# EAGLE schematic VCU_itr2 (EAGLE 9.6.2)

## Sheet 1 of 4
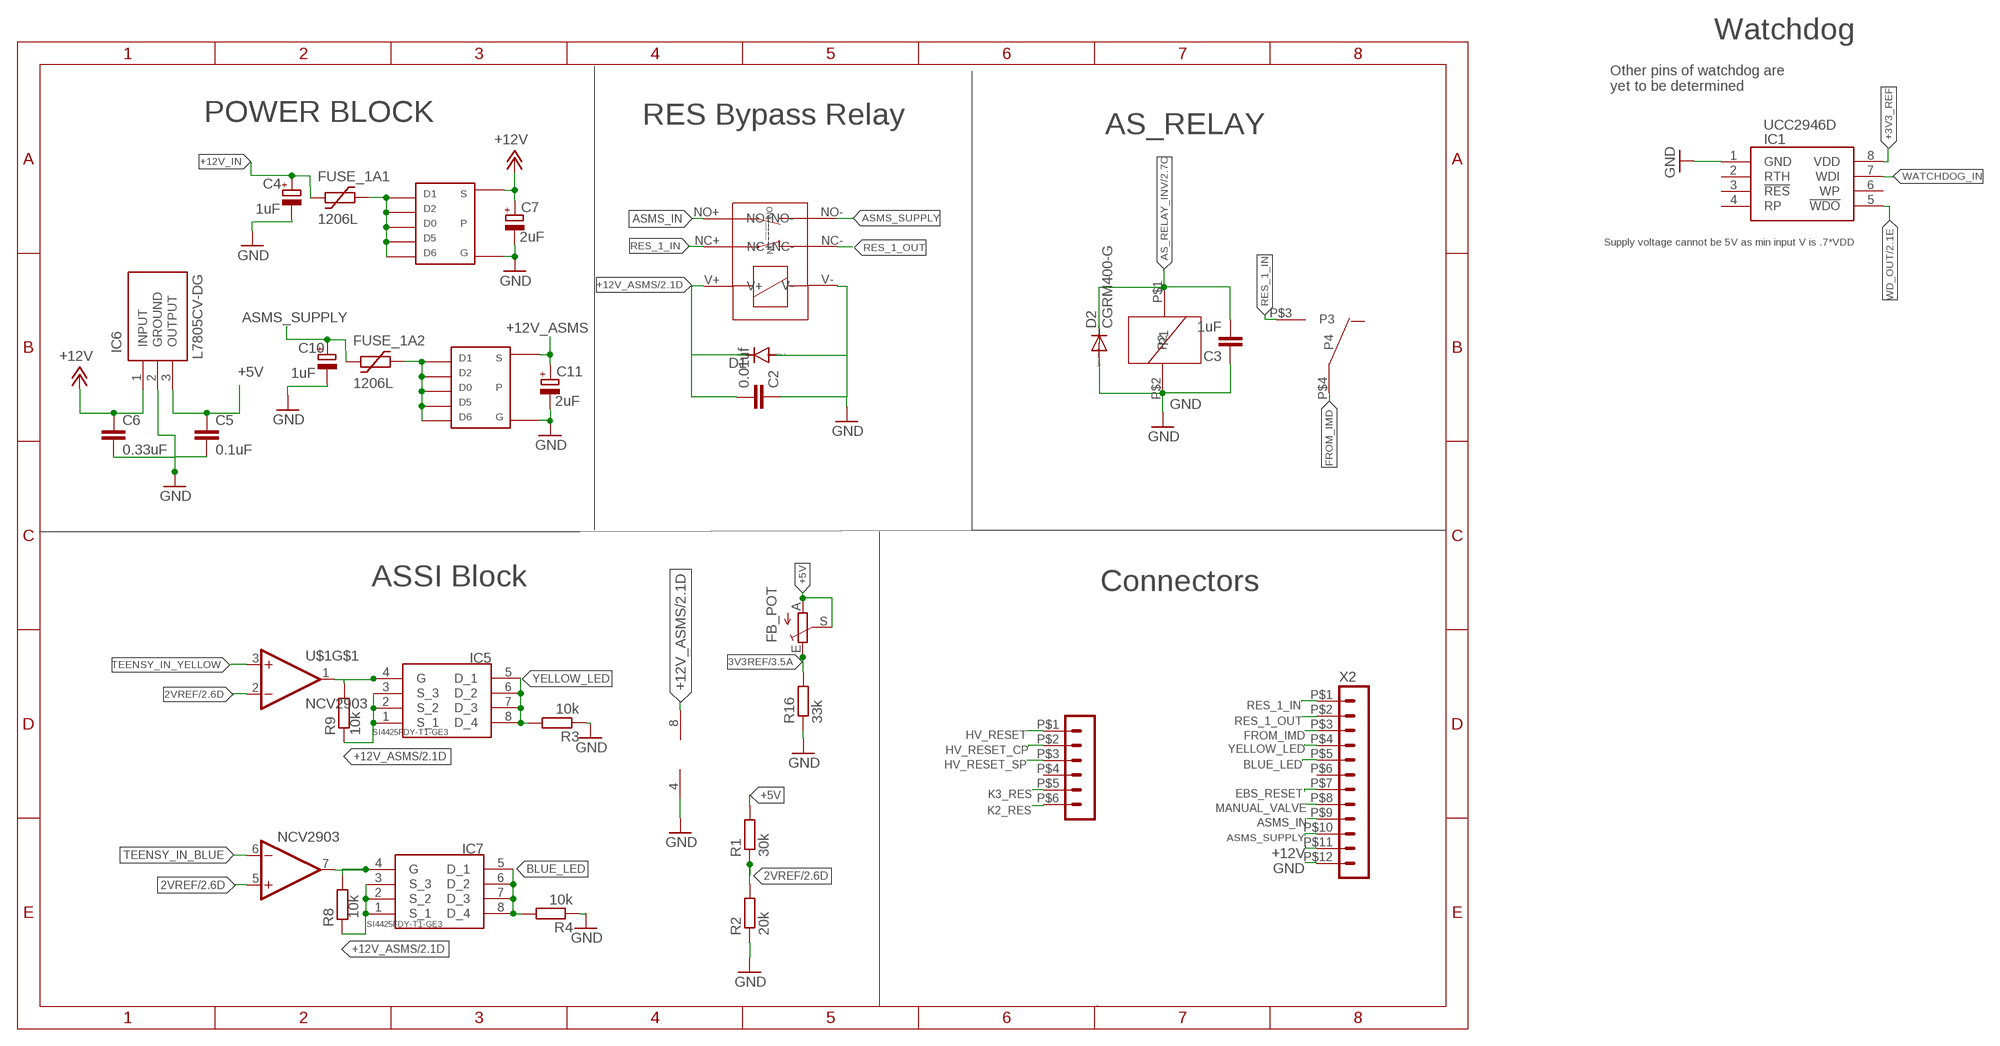
[diagram p0: schematic, sheet 1]

### Parts
BMS-CONN7  HEADER_POS6_43045-0612  [43045-0612]
C2  0.01uf  C-EUC1210  [C1210]
C3  1uF  C-EUC0805  [C0805]
C4  1uF  CPOL-EUSMCA  [SMC_A]
C5  0.1uF  C-EUC0805  [C0805]
C6  0.33uF  C-EUC0805  [C0805]
C7  2uF  CPOL-EUE2.5-6  [E2,5-6]
C10  1uF  CPOL-EUSMCA  [SMC_A]
C11  2uF  CPOL-EUE2.5-6  [E2,5-6]
D1  DIODE-DO214AC  [DO214AC]
D2  CGRM400-G  [SOD-123_MINI-SMA]
FB_POT  17k  TRIM_EU-S63S  [S63S]
FUSE_1A1  1206L  [1206L]
FUSE_1A2  1206L  [1206L]
IC1  UCC2946D  [SOIC127P600X175-8N]
IC5  SI4425FDY-T1-GE3  [SOIC127P600X175-8N]
IC6  L7805CV-DG  [TO255P460X1020X2008-3P]
IC7  SI4425FDY-T1-GE3  [SOIC127P600X175-8N]
R1  30k  R-EU_M0805  [M0805]
R2  20k  R-EU_M0805  [M0805]
R3  10k  R-EU_M0805  [M0805]
R4  10k  R-EU_M0805  [M0805]
R8  10k  R-EU_M0805  [M0805]
R9  10k  R-EU_M0805  [M0805]
R16  33k  R-EU_M0805  [M0805]
SI1  TSOP-6_PMOS  [TSOP-6_PMOS]
SI4  TSOP-6_PMOS  [TSOP-6_PMOS]
U$1  NCV2903  [SOIC-8]
U$2  G6DN_RELAY  [G6DN_RELAY]
U$9  SFM_RELAY  [SFM_RELAY]
X2  HEADER_POS12_44914-1201  [44914-1201]

### Nets
2VREF: R1.1 R2.2 U$1.2(-IN) U$1.5(+IN) ; also sheet 2
3V3REF: FB_POT.E R16.2 ; also sheet 3
+3V3_REF: IC1.8(VDD)
+5V: C5.1 FB_POT.A FB_POT.S IC6.3(OUTPUT) R1.2 ; also sheet 3
+12V: C6.1 C7.+ IC6.1(INPUT) SI1.S X2.P$11 ; also sheet 2,3
+12V_ASMS: C2.2 C11.+ D1.C IC5.1(S_1) IC5.2(S_2) IC5.3(S_3) IC7.1(S_1) IC7.2(S_2) IC7.3(S_3) R8.1 R9.1 SI4.S U$1.8(V+) U$9.V+ ; also sheet 2
+12V_IN: C4.+ FUSE_1A1.P$1
AS_RELAY_INV: C3.2 D2.C U$2.P$1(P1) ; also sheet 2
ASMS_IN: U$9.NO+ X2.P$9
ASMS_SUPPLY: C10.+ FUSE_1A2.P$1 U$9.NO- X2.P$10
BLUE_LED: IC7.5(D_1) IC7.6(D_2) IC7.7(D_3) IC7.8(D_4) R4.2 X2.P$5
EBS_RESET: X2.P$7
FROM_IMD: U$2.P$4(P4) X2.P$3
GND: C2.1 C3.1 C4.- C5.2 C6.2 C7.- C10.- C11.- D1.A D2.A IC1.1(GND) IC6.2(GROUND) R2.1 R3.1 R4.1 R16.1 SI1.G SI4.G U$1.4(V-) U$2.P$2(P2) U$9.V- X2.P$12 ; also sheet 2,3
HV_RESET: BMS-CONN7.P$1 ; also sheet 2
HV_RESET_CP: BMS-CONN7.P$2 ; also sheet 2
HV_RESET_SP: BMS-CONN7.P$3 ; also sheet 2
K2_RES: BMS-CONN7.P$6
K3_RES: BMS-CONN7.P$5
MANUAL_VALVE: X2.P$8 ; also sheet 2
N$1: IC7.4(G) R8.2 U$1.7(OUT)
N$3: IC5.4(G) R9.2 U$1.1(OUT)
N$7: FUSE_1A2.P$2 SI4.1 SI4.2 SI4.5 SI4.6 SI4.D(D0)
N$9: FUSE_1A1.P$2 SI1.1 SI1.2 SI1.5 SI1.6 SI1.D(D0)
RES_1_IN: U$2.P$3(P3) U$9.NC+ X2.P$1
RES_1_OUT: U$9.NC- X2.P$2
TEENSY_IN_BLUE: U$1.6(-IN)
TEENSY_IN_YELLOW: U$1.3(+IN)
WATCHDOG_IN: IC1.7(WDI)
WD_OUT: IC1.5(!WDO) ; also sheet 2
YELLOW_LED: IC5.5(D_1) IC5.6(D_2) IC5.7(D_3) IC5.8(D_4) R3.2 X2.P$4
Unconnected: BMS-CONN7.P$4 IC1.2(RTH) IC1.3(!RES) IC1.4(RP) IC1.6(WP) X2.P$6

### Notes on the sheet
- Watchdog
- Other pins of watchdog are
  yet to be determined
- POWER BLOCK | RES Bypass Relay
- AS_RELAY
- Supply voltage cannot be 5V as min input V is .7*VDD
- ASSI Block | Connectors

## Sheet 2 of 4
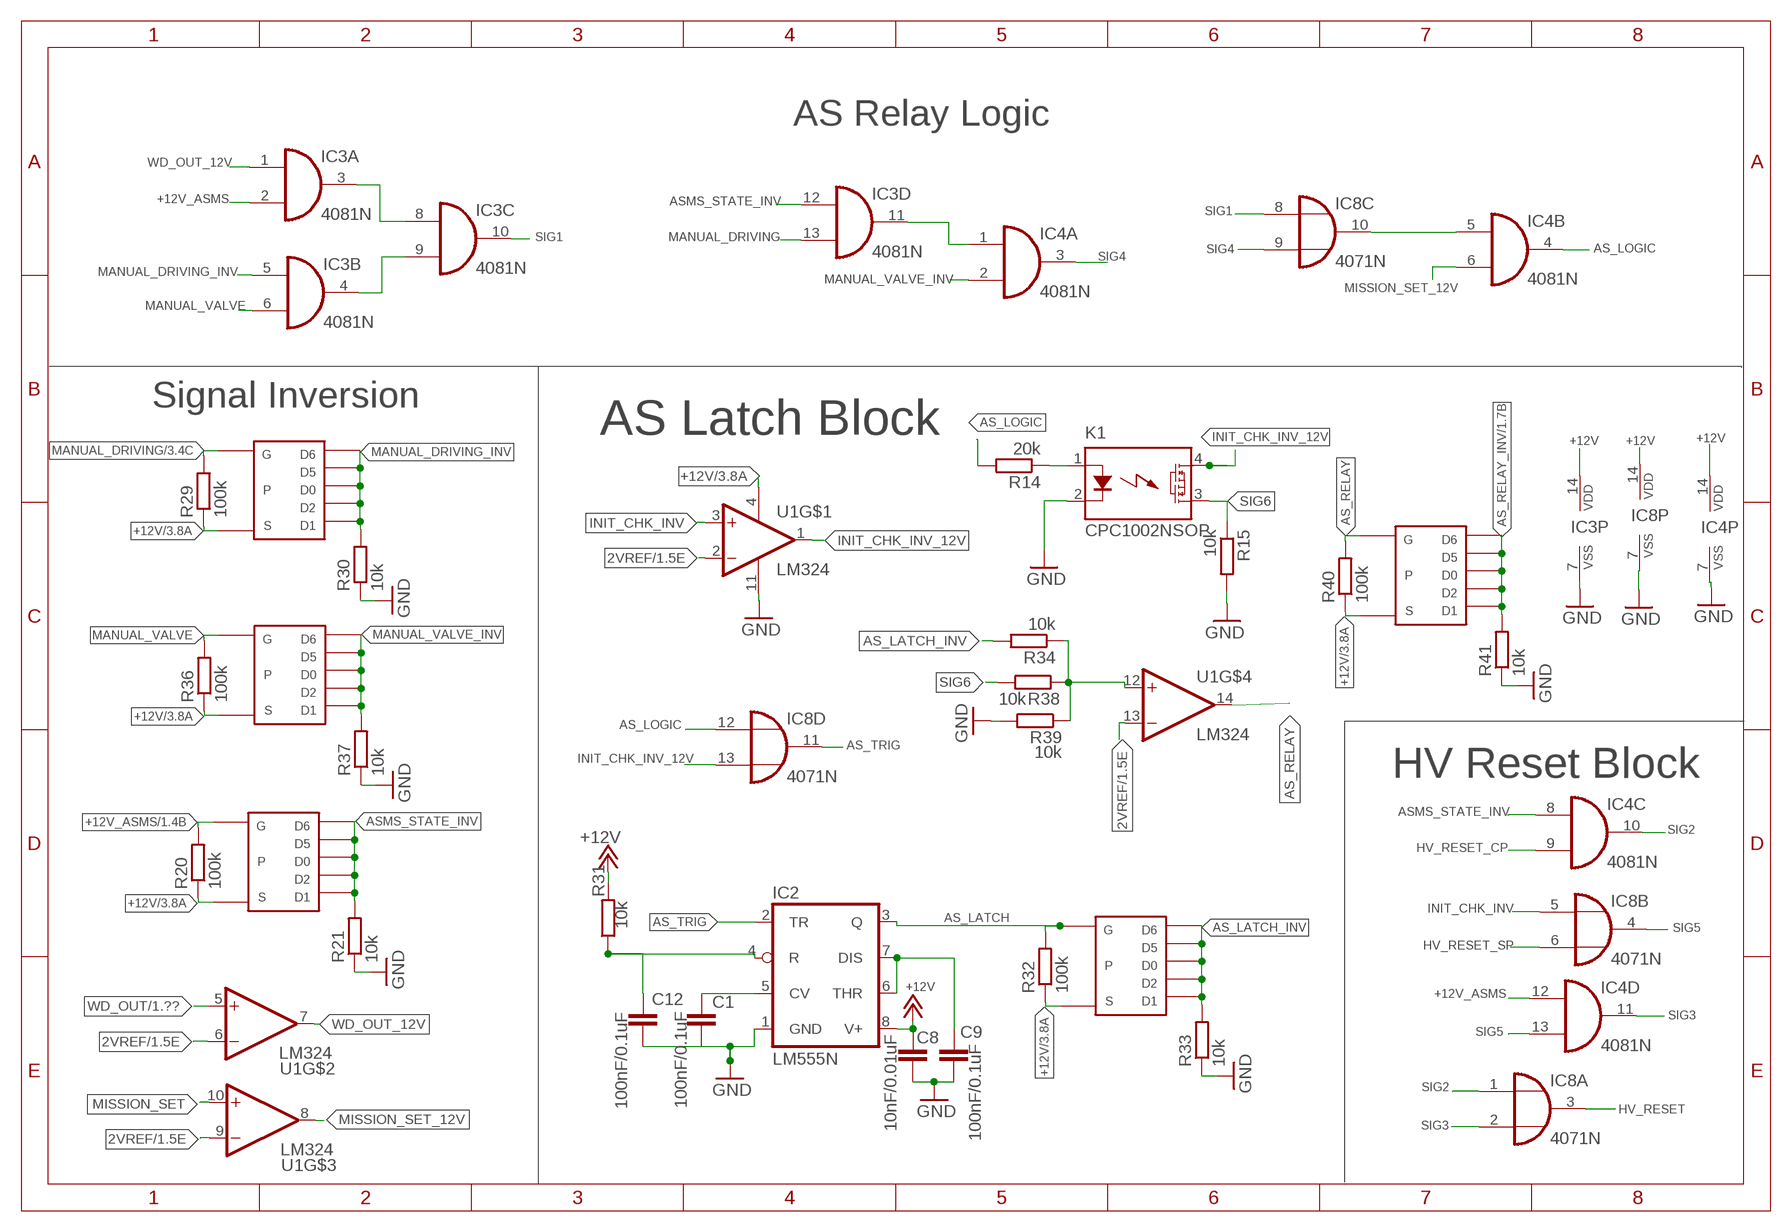
[diagram p1: schematic, sheet 2]

### Parts
C1  100nF/0.1uF  C-EUC0805  [C0805]
C8  10nF/0.01uF  C-EUC0805  [C0805]
C9  100nF/0.1uF  C-EUC0805  [C0805]
C12  100nF/0.1uF  C-EUC0805  [C0805]
IC2  LM555N  [DIL08]
IC3  4081N  [DIL14]
IC4  4081N  [DIL14]
IC8  4071N  [DIL14]
K1  CPC1002NSOP  [SOP04]
R14  20k  R-EU_R0805  [R0805]
R15  10k  R-EU_R0805  [R0805]
R20  100k  R-EU_M0805  [M0805]
R21  10k  R-EU_M0805  [M0805]
R29  100k  R-EU_M0805  [M0805]
R30  10k  R-EU_M0805  [M0805]
R31  10k  R-EU_R0805  [R0805]
R32  100k  R-EU_M0805  [M0805]
R33  10k  R-EU_M0805  [M0805]
R34  10k  R-EU_M0805  [M0805]
R36  100k  R-EU_M0805  [M0805]
R37  10k  R-EU_M0805  [M0805]
R38  10k  R-EU_M0805  [M0805]
R39  10k  R-EU_M0805  [M0805]
R40  100k  R-EU_M0805  [M0805]
R41  10k  R-EU_M0805  [M0805]
SI2  TSOP-6_PMOS  [TSOP-6_PMOS]
SI3  TSOP-6_PMOS  [TSOP-6_PMOS]
SI5  TSOP-6_PMOS  [TSOP-6_PMOS]
SI6  TSOP-6_PMOS  [TSOP-6_PMOS]
SI7  TSOP-6_PMOS  [TSOP-6_PMOS]
U1  LM324  [SOIC127P600X175-14N]

### Nets
2VREF: U1.2(INVERTING_INPUT1) U1.6(INVERTING_INPUT2) U1.9(INVERTING_INPUT3) U1.13(INVERTING_INPUT4) ; also sheet 1
+12V: C8.1 IC2.8(V+) IC3.14(P:VDD) IC4.14(P:VDD) IC8.14(P:VDD) R20.1 R29.1 R31.2 R32.1 R36.1 R40.1 SI2.S SI3.S SI5.S SI6.S SI7.S U1.4(VCC+) ; also sheet 1,3
+12V_ASMS: IC3.2(A:I1) IC4.12(D:I0) R20.2 SI5.G ; also sheet 1
AS_LATCH: IC2.3(Q) R32.2 SI2.G
AS_LATCH_INV: R33.2 R34.2 SI2.1 SI2.2 SI2.5 SI2.6 SI2.D(D0)
AS_LOGIC: IC4.4(B:O) IC8.12(D:I0) R14.2
AS_RELAY: R40.2 SI3.G U1.14(OUTPUT4)
AS_RELAY_INV: R41.2 SI3.1 SI3.2 SI3.5 SI3.6 SI3.D(D0) ; also sheet 1
AS_TRIG: IC2.2(TR) IC8.11(D:O)
ASMS_STATE_INV: IC3.12(D:I0) IC4.8(C:I0) R21.2 SI5.1 SI5.2 SI5.5 SI5.6 SI5.D(D0)
GND: C1.2 C8.2 C9.2 C12.2 IC2.1(GND) IC3.7(P:VSS) IC4.7(P:VSS) IC8.7(P:VSS) K1.2(K) R15.2 R21.1 R30.1 R33.1 R37.1 R39.2 R41.1 U1.11(VCC-) ; also sheet 1,3
HV_RESET: IC8.3(A:O) ; also sheet 1
HV_RESET_CP: IC4.9(C:I1) ; also sheet 1
HV_RESET_SP: IC8.6(B:I1) ; also sheet 1
INIT_CHK_INV: IC8.5(B:I0) U1.3(NON-INVERTING_INPUT1)
INIT_CHK_INV_12V: IC8.13(D:I1) K1.4(DS1) U1.1(OUTPUT1)
MANUAL_DRIVING: IC3.13(D:I1) R29.2 SI6.G ; also sheet 3
MANUAL_DRIVING_INV: IC3.5(B:I0) R30.2 SI6.1 SI6.2 SI6.5 SI6.6 SI6.D(D0)
MANUAL_VALVE: IC3.6(B:I1) R36.2 SI7.G ; also sheet 1
MANUAL_VALVE_INV: IC4.2(A:I1) R37.2 SI7.1 SI7.2 SI7.5 SI7.6 SI7.D(D0)
MISSION_SET: U1.10(NON-INVERTING_INPUT3)
MISSION_SET_12V: IC4.6(B:I1) U1.8(OUTPUT3)
N$2: IC4.5(B:I0) IC8.10(C:O)
N$10: IC3.3(A:O) IC3.8(C:I0)
N$11: IC3.4(B:O) IC3.9(C:I1)
N$12: IC3.11(D:O) IC4.1(A:I0)
N$15: K1.1(A) R14.1
N$16: R34.1 R38.1 R39.1 U1.12(NON-INVERTING_INPUT4)
N$17: C12.1 IC2.4(R) R31.1
N$18: C1.1 IC2.5(CV)
N$19: C9.1 IC2.6(THR) IC2.7(DIS)
SIG1: IC3.10(C:O) IC8.8(C:I0)
SIG2: IC4.10(C:O) IC8.1(A:I0)
SIG3: IC4.11(D:O) IC8.2(A:I1)
SIG4: IC4.3(A:O) IC8.9(C:I1)
SIG5: IC4.13(D:I1) IC8.4(B:O)
SIG6: K1.3(DS2) R15.1 R38.2
WD_OUT: U1.5(NON-INVERTING_INPUT2) ; also sheet 1
WD_OUT_12V: IC3.1(A:I0) U1.7(OUTPUT2)

### Notes on the sheet
- AS Relay Logic
- Signal Inversion
- AS Latch Block
- HV Reset Block

## Sheet 3 of 4
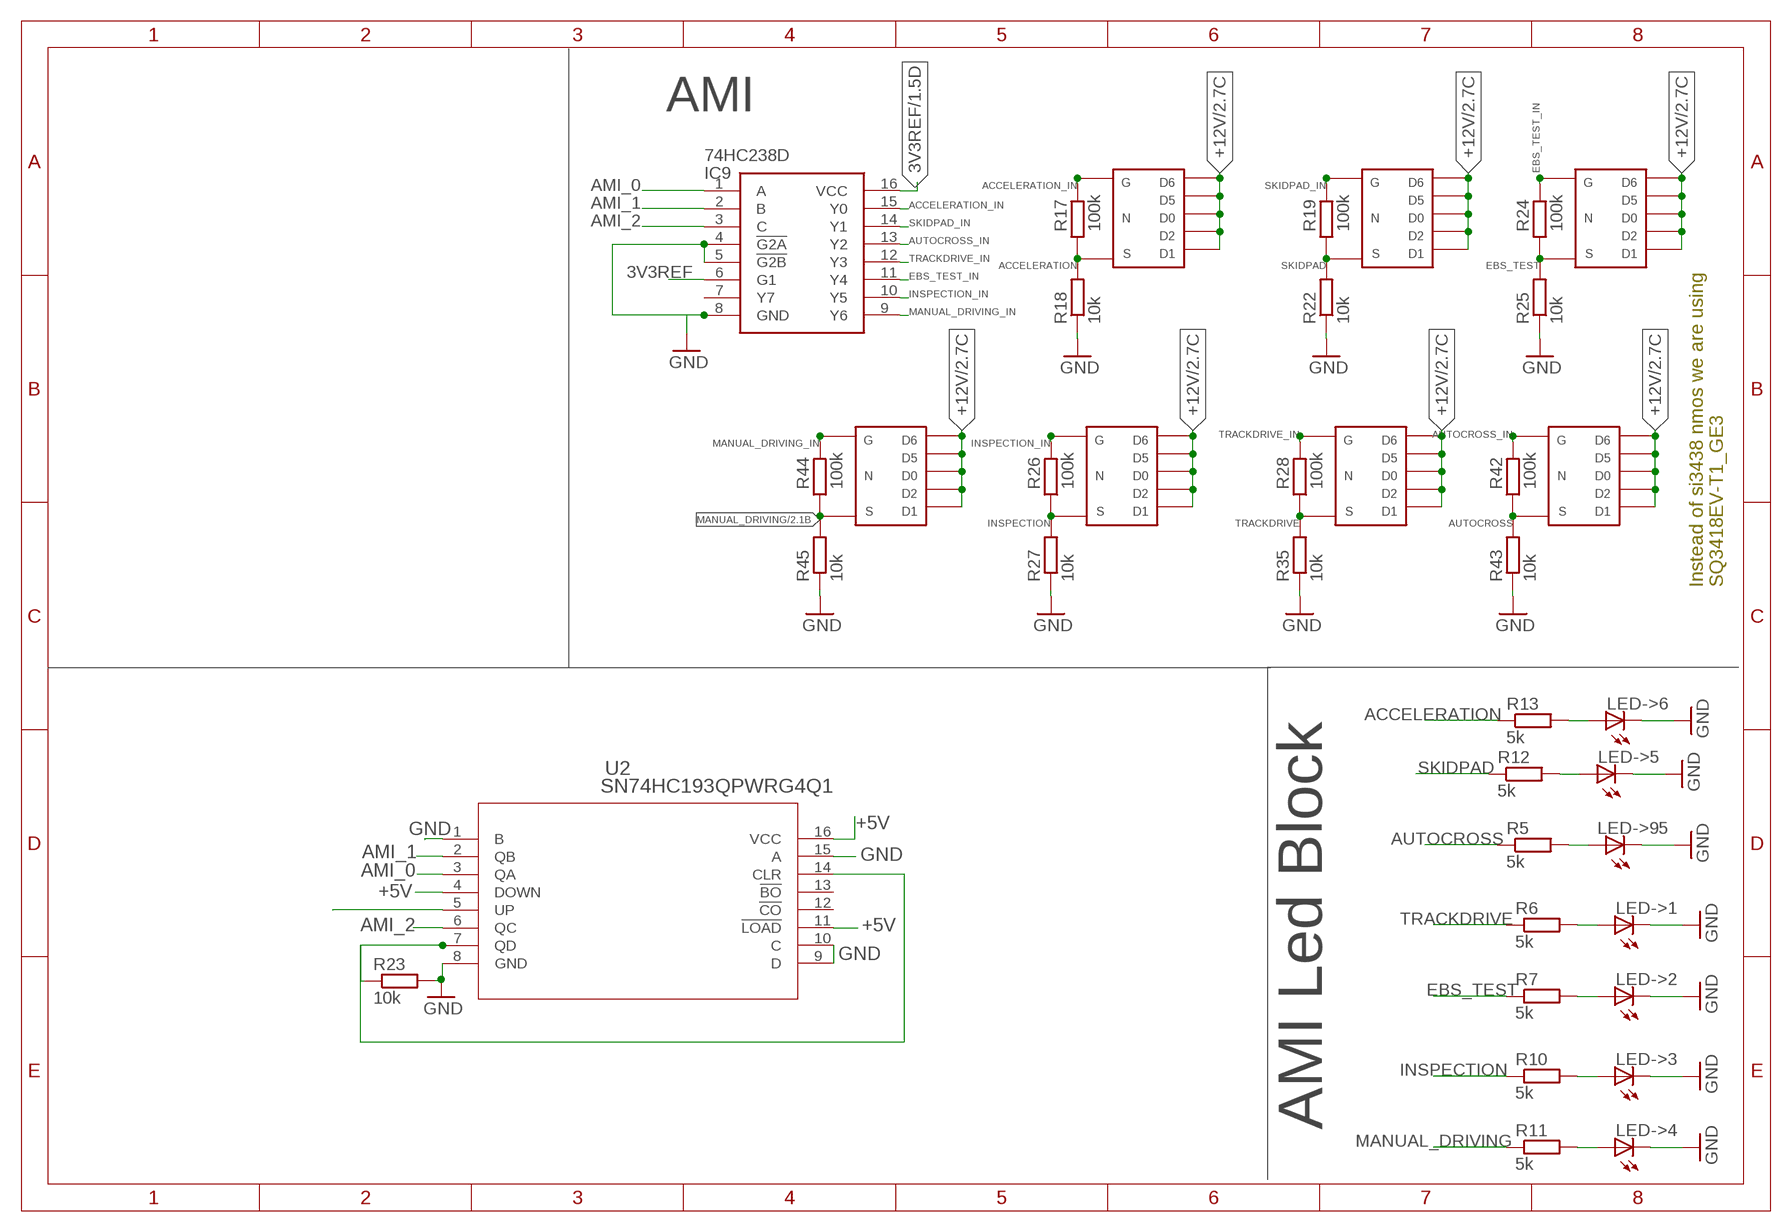
[diagram p2: schematic, sheet 3]

### Parts
IC9  74HC238D  [SOIC127P600X175-16N]
LED->1  LED-FKIT-1206  [FKIT-LED-1206]
LED->2  LED-FKIT-1206  [FKIT-LED-1206]
LED->3  LED-FKIT-1206  [FKIT-LED-1206]
LED->4  LED-FKIT-1206  [FKIT-LED-1206]
LED->5  LED-FKIT-1206  [FKIT-LED-1206]
LED->6  LED-FKIT-1206  [FKIT-LED-1206]
LED->95  LED-FKIT-1206  [FKIT-LED-1206]
R5  5k  R-EU_R0805  [R0805]
R6  5k  R-EU_R0805  [R0805]
R7  5k  R-EU_R0805  [R0805]
R10  5k  R-EU_R0805  [R0805]
R11  5k  R-EU_R0805  [R0805]
R12  5k  R-EU_R0805  [R0805]
R13  5k  R-EU_R0805  [R0805]
R17  100k  R-EU_R0805  [R0805]
R18  10k  R-EU_M0805  [M0805]
R19  100k  R-EU_R0805  [R0805]
R22  10k  R-EU_M0805  [M0805]
R23  10k  R-EU_M0805  [M0805]
R24  100k  R-EU_R0805  [R0805]
R25  10k  R-EU_M0805  [M0805]
R26  100k  R-EU_R0805  [R0805]
R27  10k  R-EU_M0805  [M0805]
R28  100k  R-EU_R0805  [R0805]
R35  10k  R-EU_M0805  [M0805]
R42  100k  R-EU_R0805  [R0805]
R43  10k  R-EU_M0805  [M0805]
R44  100k  R-EU_R0805  [R0805]
R45  10k  R-EU_M0805  [M0805]
U2  SN74HC193QPWRG4Q1  [PW16]
U$13  TSOP-6_NMOS  [TSOP-6_NMOS]
U$14  TSOP-6_NMOS  [TSOP-6_NMOS]
U$15  TSOP-6_NMOS  [TSOP-6_NMOS]
U$16  TSOP-6_NMOS  [TSOP-6_NMOS]
U$17  TSOP-6_NMOS  [TSOP-6_NMOS]
U$18  TSOP-6_NMOS  [TSOP-6_NMOS]
U$19  TSOP-6_NMOS  [TSOP-6_NMOS]

### Nets
3V3REF: IC9.6(G1) IC9.16(VCC) ; also sheet 1
+5V: U2.4(DOWN) U2.11(!LOAD) U2.16(VCC) ; also sheet 1
+12V: U$13.1 U$13.2 U$13.5 U$13.6 U$13.D(D0) U$14.1 U$14.2 U$14.5 U$14.6 U$14.D(D0) U$15.1 U$15.2 U$15.5 U$15.6 U$15.D(D0) U$16.1 U$16.2 U$16.5 U$16.6 U$16.D(D0) U$17.1 U$17.2 U$17.5 U$17.6 U$17.D(D0) U$18.1 U$18.2 U$18.5 U$18.6 U$18.D(D0) U$19.1 U$19.2 U$19.5 U$19.6 U$19.D(D0) ; also sheet 1,2
ACCELERATION: R13.1 R17.1 R18.2 U$13.S
ACCELERATION_IN: IC9.15(Y0) R17.2 U$13.G
AMI_0: IC9.1(A) U2.3(QA)
AMI_1: IC9.2(B) U2.2(QB)
AMI_2: IC9.3(C) U2.6(QC)
AUTOCROSS: R5.1 R42.1 R43.2 U$18.S
AUTOCROSS_IN: IC9.13(Y2) R42.2 U$18.G
EBS_TEST: R7.1 R24.1 R25.2 U$15.S
EBS_TEST_IN: IC9.11(Y4) R24.2 U$15.G
GND: IC9.4(!G2A) IC9.5(!G2B) IC9.8(GND) LED->1.C LED->2.C LED->3.C LED->4.C LED->5.C LED->6.C LED->95.C R18.1 R22.1 R23.2 R25.1 R27.1 R35.1 R43.1 R45.1 U2.1(B) U2.8(GND) U2.9(D) U2.10(C) U2.15(A) ; also sheet 1,2
INSPECTION: R10.1 R26.1 R27.2 U$16.S
INSPECTION_IN: IC9.10(Y5) R26.2 U$16.G
MANUAL_DRIVING: R11.1 R44.1 R45.2 U$19.S ; also sheet 2
MANUAL_DRIVING_IN: IC9.9(Y6) R44.2 U$19.G
N$4: LED->2.A R7.2
N$5: LED->4.A R11.2
N$6: LED->1.A R6.2
N$8: LED->3.A R10.2
N$13: LED->5.A R12.2
N$14: LED->6.A R13.2
N$20: R23.1 U2.7(QD) U2.14(CLR)
N$21: U2.5(UP)
N$28: LED->95.A R5.2
SKIDPAD: R12.1 R19.1 R22.2 U$14.S
SKIDPAD_IN: IC9.14(Y1) R19.2 U$14.G
TRACKDRIVE: R6.1 R28.1 R35.2 U$17.S
TRACKDRIVE_IN: IC9.12(Y3) R28.2 U$17.G
Unconnected: IC9.7(Y7) U2.12(!CO) U2.13(!BO)

### Notes on the sheet
- AMI
- Instead of si3438 nmos we are using
  SQ3418EV-T1_GE3
- AMI Led Block

## Sheet 4 of 4
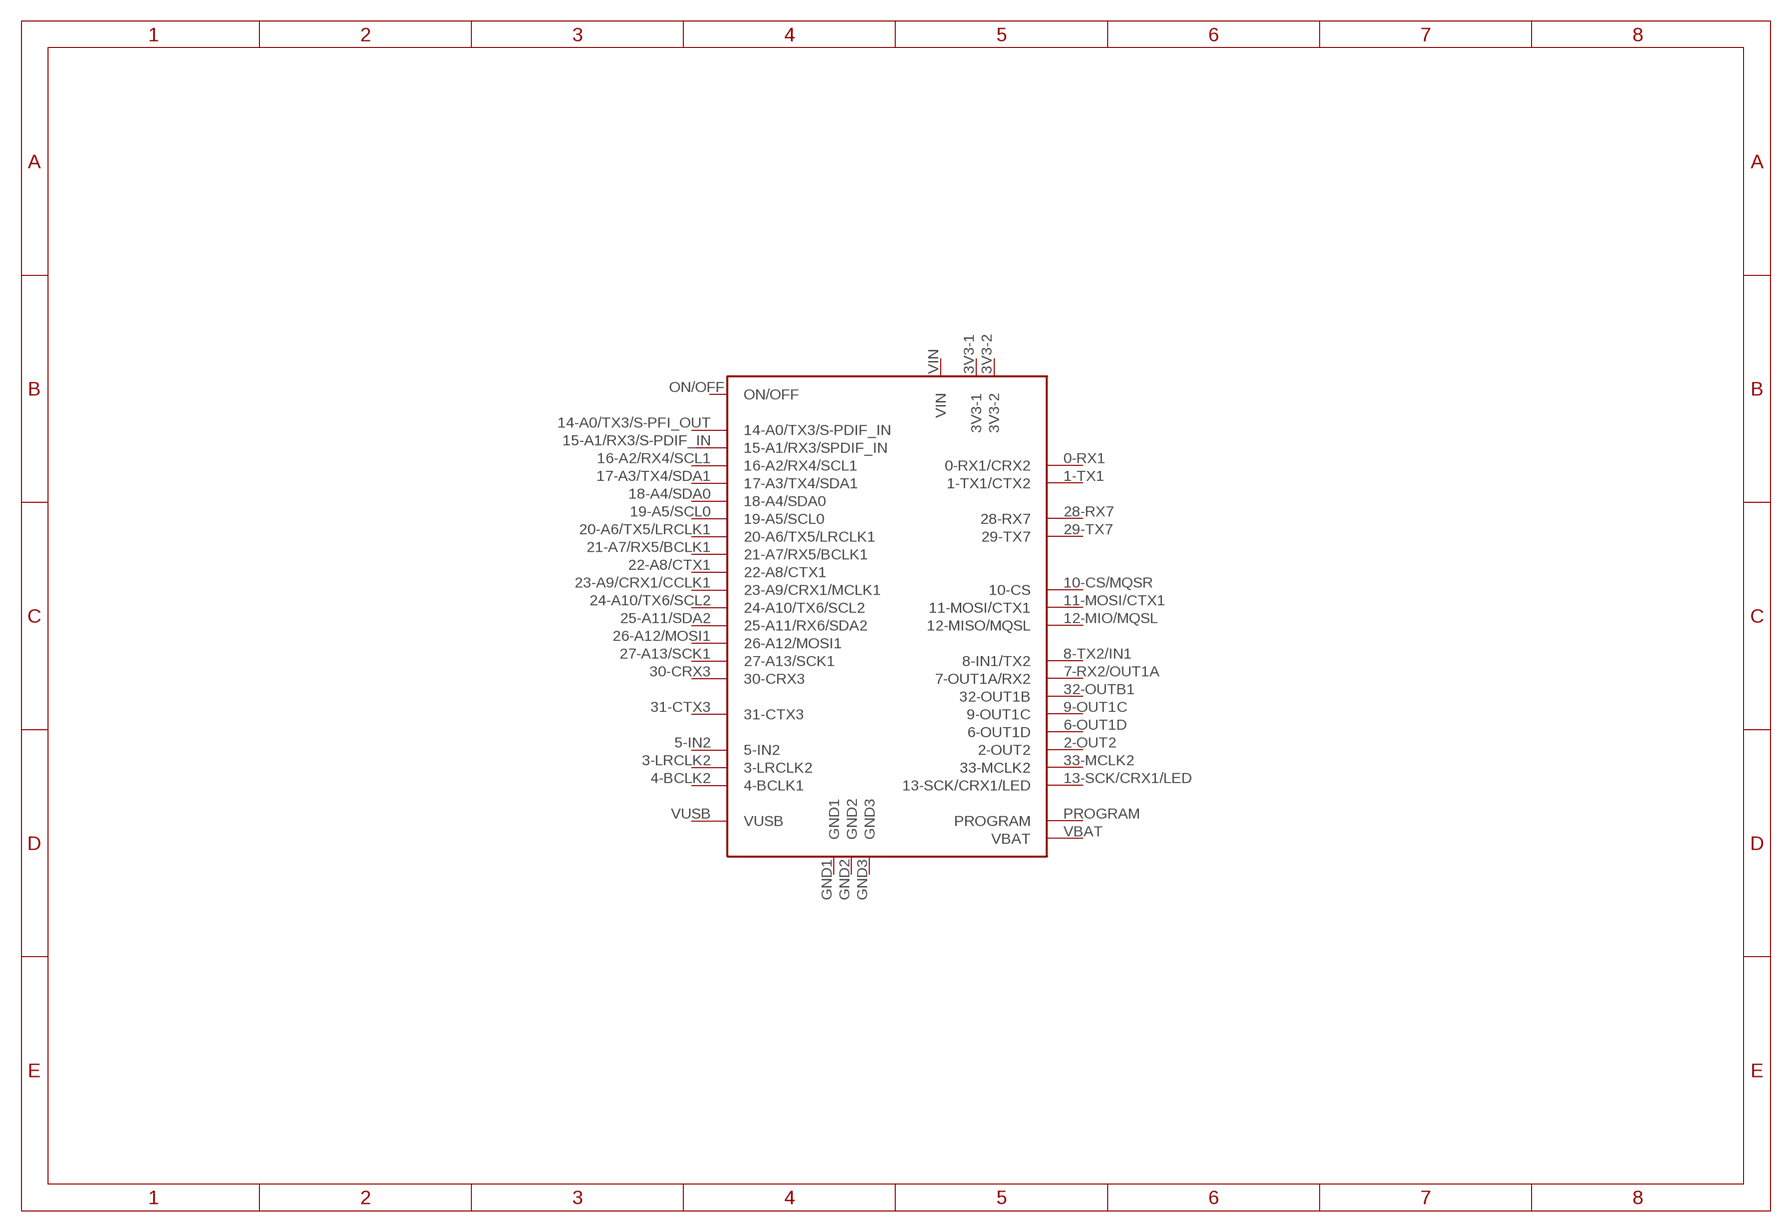
[diagram p3: schematic, sheet 4]

### Parts
U$3  TEENSY40  [TEENSY40]
Unconnected: U$3.0-RX1(0-RX1/CRX2) U$3.1-TX1(1-TX1/CTX2) U$3.2-OUT2 U$3.3-LRCLK2 U$3.3V3-1 U$3.3V3-2 U$3.4-BCLK2(4-BCLK1) U$3.5-IN2 U$3.6-OUT1D U$3.7-RX2/OUT1A(7-OUT1A/RX2) U$3.8-TX2/IN1(8-IN1/TX2) U$3.9-OUT1C U$3.10-CS/MQSR(10-CS) U$3.11-MOSI/CTX1 U$3.12-MIO/MQSL(12-MISO/MQSL) U$3.13-SCK/CRX1/LED U$3.14-A0/TX3/S-PFI_OUT(14-A0/TX3/S-PDIF_IN) U$3.15-A1/RX3/S-PDIF_IN(15-A1/RX3/SPDIF_IN) U$3.16-A2/RX4/SCL1 U$3.17-A3/TX4/SDA1 U$3.18-A4/SDA0 U$3.19-A5/SCL0 U$3.20-A6/TX5/LRCLK1 U$3.21-A7/RX5/BCLK1 U$3.22-A8/CTX1 U$3.23-A9/CRX1/CCLK1(23-A9/CRX1/MCLK1) U$3.24-A10/TX6/SCL2 U$3.25-A11/SDA2(25-A11/RX6/SDA2) U$3.26-A12/MOSI1 U$3.27-A13/SCK1 U$3.28-RX7 U$3.29-TX7 U$3.30-CRX3 U$3.31-CTX3 U$3.32-OUTB1(32-OUT1B) U$3.33-MCLK2 U$3.GND1 U$3.GND2 U$3.GND3 U$3.ON/OFF U$3.PROGRAM U$3.VBAT U$3.VIN U$3.VUSB

## Library data of the parts
BMS-CONN7 = con-molex-micro-fit-3_0:HEADER_POS6_?: Molex - Micro-Fit 3.0 Series connector, 3.00mm (0.118") pitch header, 6 positions.
C1-C3 C8 C9 C12 = IIT_BOMBAY_Racing:C-EU: CAPACITOR, European symbol
C4 C7 C10 C11 = IIT_BOMBAY_Racing:CPOL-EU: POLARIZED CAPACITOR, European symbol
C5 C6 = rcl:C-EU: CAPACITOR, European symbol; SPICEPREFIX: C
D1 = diode:DIODE-: DIODE
D2 = IIT_BOMBAY_Racing:CGRM400*-G: Molded plasitc,JEDEC SOD-123/Mini SMA Source: Comchip CGRM4001-G.pdf
FB_POT = IIT_BOMBAY_Racing:TRIM_EU-: POTENTIOMETER
FUSE_1A1 FUSE_1A2 = IIT_BOMBAY_Racing2:1206L
IC1 = UCC2946D:UCC2946D: Texas Instruments UCC2946D, Processor Supervisor 2.1 5.5 V, WDT, Reset Input, 8-Pin SOIC Source: Datasheet <http://www.ti.com/lit/gpn/UCC2946>; ARROW_PART_NUMBER: UCC2946D; ARROW_PRICE-STOCK: https://www.arrow.com/en/products/ucc2946d/texas-instruments?region=nac; DESCRIPTION: Texas Instruments UCC2946D, Processor Supervisor 2.1 5.5 V, WDT, Reset Input, 8-Pin SOIC; HEIGHT: 1.75mm; MANUFACTURER_NAME: Texas Instruments; MANUFACTURER_PART_NUMBER: UCC2946D; MOUSER_PART_NUMBER: 595-UCC2946D; MOUSER_PRICE-STOCK: https://www.mouser.co.uk/ProductDetail/Texas-Instruments/UCC2946D?qs=eJkN62t4xTUTFIqfTGcQjw%3D%3D
IC2 = linear:*555: TIMER
IC3 IC4 = IIT_BOMBAY_Racing:4081: Quad 2-input AND
IC5 IC7 = SamacSys_Parts:SI4425FDY-T1-GE3: MOSFET P-CHANNEL 30-V (D-S) MOSFET Source: Datasheet <https://www.vishay.com/docs/77095/si4425fdy.pdf>; DESCRIPTION: MOSFET P-CHANNEL 30-V (D-S) MOSFET; HEIGHT: 1.75mm; MANUFACTURER_NAME: Vishay; MANUFACTURER_PART_NUMBER: SI4425FDY-T1-GE3; MOUSER_PART_NUMBER: 78-SI4425FDY-T1-GE3; MOUSER_PRICE-STOCK: https://www.mouser.co.uk/ProductDetail/Vishay-Siliconix/SI4425FDY-T1-GE3?qs=%252B6g0mu59x7IUQKSn86z1oQ%3D%3D
IC6 = SamacSys_Parts:L7805CV-DG: Voltage Regulator 5V 4% 1.5A TO220 L7805CV-DG, Linear Voltage Regulator, Current Limit, Shut-Down 1.5A 5 V, 3-Pin TO220 Source: Datasheet <http://www.st.com/web/en/resource/technical/document/datasheet/CD00000444.pdf>; DESCRIPTION: Voltage Regulator 5V 4% 1.5A TO220 L7805CV-DG, Linear Voltage Regulator, Current Limit, Shut-Down 1.5A 5 V, 3-Pin TO220; HEIGHT: 4.6mm; MANUFACTURER_NAME: STMicroelectronics; MANUFACTURER_PART_NUMBER: L7805CV-DG; MOUSER_PART_NUMBER: 511-L7805CV-DG; MOUSER_PRICE-STOCK: https://www.mouser.co.uk/ProductDetail/STMicroelectronics/L7805CV-DG?qs=T%2FOtf55vL7c3O0as9P9fAw%3D%3D
IC8 = 40xx:4071: Quad 2-input OR
IC9 = 74HC238D:74HC238D: (1) High speed: tpd = 14 ns (typ.) at VCC = 5 V (2) Low power dissipation: ICC = 4.0 A (max) at T a = 25 (3) Balanced propagation delays: tPLH tPHL (4) Wide operating voltage range: VCC(opr) = 2.0 V to 6.0 V Source: Datasheet <https://toshiba.semicon-storage.com/info/docget.jsp?did=37298&prodName=74HC238D>; ARROW_PART_NUMBER: 74HC238D; ARROW_PRICE-STOCK: https://www.arrow.com/en/products/74hc238d/toshiba?region=nac; DESCRIPTION: (1) High speed: tpd = 14 ns (typ.) at VCC = 5 V (2) Low power dissipation: ICC = 4.0 A (max) at T a = 25 (3) Balanced propagation delays: tPLH tPHL (4) Wide operating voltage range: VCC(opr) = 2.0 V to 6.0 V; HEIGHT: 1.75mm; MANUFACTURER_NAME: Toshiba; MANUFACTURER_PART_NUMBER: 74HC238D; MOUSER_PART_NUMBER: 757-74HC238D; MOUSER_PRICE-STOCK: https://www.mouser.co.uk/ProductDetail/Toshiba/74HC238D?qs=7EBvPakHacU5yOgCN8ruRw%3D%3D
K1 = CPC1002N:CPC1002N: PhotoMOS Relay NAiS Source: http://www.panasonic-electric-works.com/catalogues/downloads/photomos/ds_x615_en_aqz10_20.pdf
LED->1-LED->6 LED->95 = IIT_BOMBAY_Racing:LED: LEDs Standard schematic elements and footprints for 5mm, 3mm, 1206, and 0603 sized LEDs. 5mm - Spark Fun Electronics SKU : COM-00529 (and others)
R1-R4 R8 R9 R16 R18 R20-R23 R25 R27 R29 R30 R32-R41 R43 R45 = IIT_BOMBAY_Racing2:R-EU_: RESISTOR, European symbol
R5-R7 R10-R15 R17 R19 R24 R26 R28 R31 R42 R44 = IIT_BOMBAY_Racing:R-EU_: RESISTOR, European symbol
SI1-SI7 = TSOP-6_MOS:TSOP-6_PMOS
U1 = LM324:LM324: these devices consist of four independent high-gain frequency-compensated operational amplifiers that are designed sp... Check availability <https://pricing.snapeda.com/parts/LM324../Intersil/view-part?ref=eda>; AVAILABILITY: Not in stock; DESCRIPTION: Quad OpAmp; MF: Intersil; MP: LM324..; PACKAGE: None; PRICE: None
U2 = counter_3bit:SN74HC193QPWRG4Q1; COPYRIGHT: Copyright (C) 2024 Ultra Librarian. All rights reserved.; MANUFACTURER_PART_NUMBER: SN74HC193QPWRG4Q1; MFR_NAME: Texas Instruments
U$1 = IIT_BOMBAY_Racing2:NCV2903
U$2 = G6DN_Omron:G6DN_RELAY
U$3 = teensy:TEENSY40: Teensy 4.0 device including POGO pins for pins 24 - 33, but not yet pins for D+ and D-. Symbol layout is what works for me and may not suite everyone... that can be added or additional symbols can be created to be used in a modilied davie name.; SPICEPREFIX: X
U$9 = bypass_relay:SFM_RELAY
U$13-U$19 = ACU-MOSFET-updated:TSOP-6_NMOS
X2 = IIT_BOMBAY_Racing:HEADER_POS12_?: Molex - Micro-Fit 3.0 Series connector, 3.00mm (0.118") pitch header, 12 positions.